# EAGLE design Top (EAGLE 9.6.2)
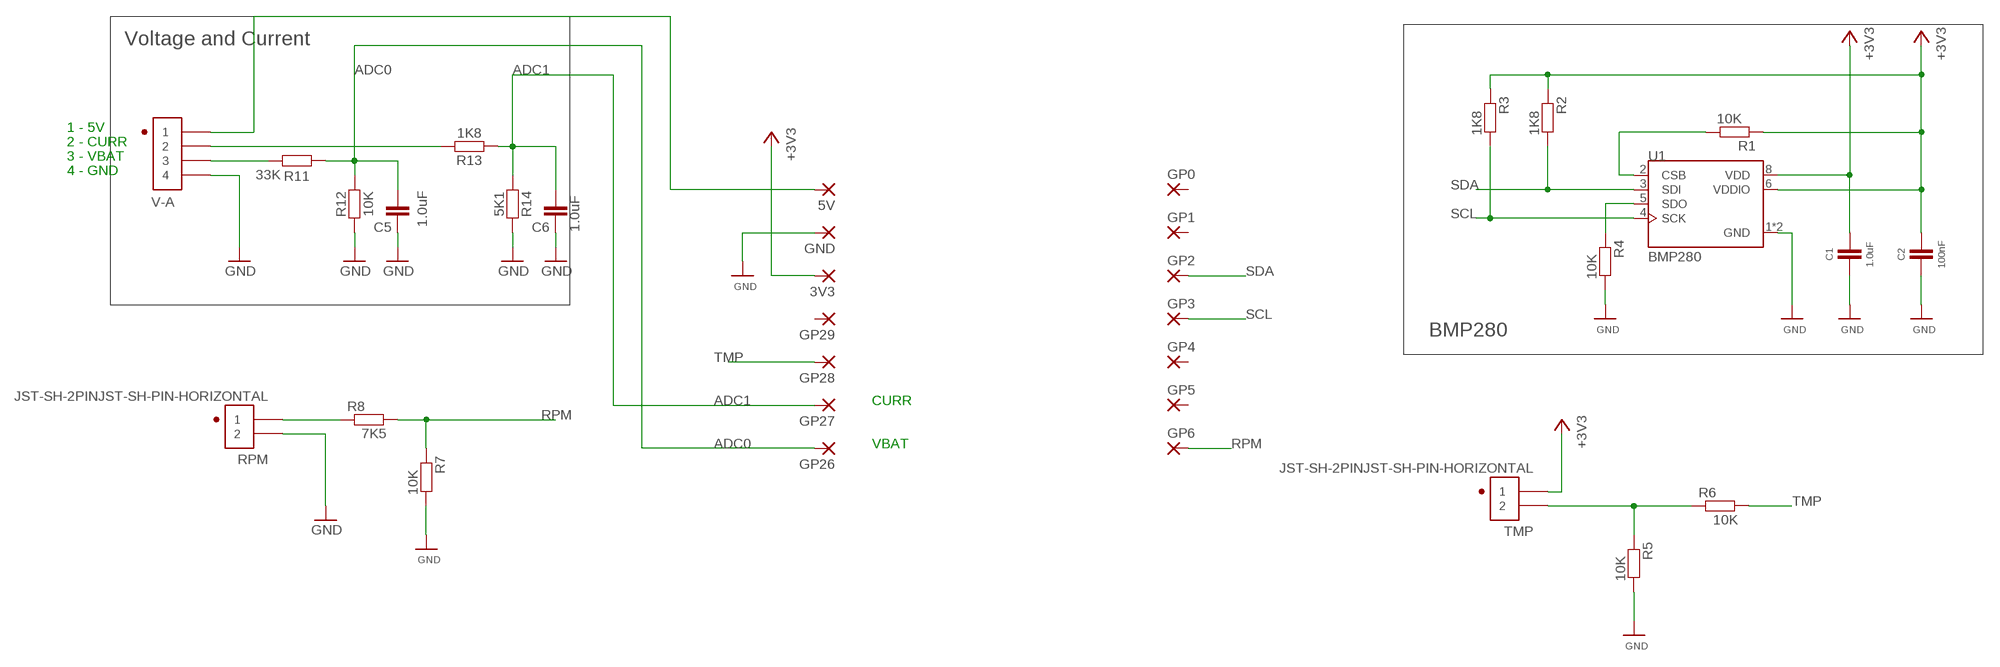
[diagram p0: schematic, sheet 1]

## Parts
3V3  1,6/0,9  [1,6/0,9]
5V  1,6/0,9  [1,6/0,9]
C1  1.0uF  1.0UF-0402-16V-10%  [0402]
C2  100nF  1.0UF-0603-16V-10%  [0603]
C5  1.0uF  1.0UF-0603-16V-10%-X7R  [0603]
C6  1.0uF  1.0UF-0603-16V-10%-X7R  [0603]
GND  1,6/0,9  [1,6/0,9]
GP0  1,6/0,9  [1,6/0,9]
GP1  1,6/0,9  [1,6/0,9]
GP2  1,6/0,9  [1,6/0,9]
GP3  1,6/0,9  [1,6/0,9]
GP4  1,6/0,9  [1,6/0,9]
GP5  1,6/0,9  [1,6/0,9]
GP6  1,6/0,9  [1,6/0,9]
GP26  1,6/0,9  [1,6/0,9]
GP27  1,6/0,9  [1,6/0,9]
GP28  1,6/0,9  [1,6/0,9]
GP29  1,6/0,9  [1,6/0,9]
R1  10K  RESISTOR0603  [0603]
R2  1K8  RESISTOR0603  [0603]
R3  1K8  RESISTOR0603  [0603]
R4  10K  RESISTOR0603  [0603]
R5  10K  RESISTOR0603  [0603]
R6  10K  RESISTOR0603  [0603]
R7  10K  RESISTOR0603  [0603]
R8  7K5  RESISTOR0603  [0603]
R11  33K  RESISTOR0603  [0603]
R12  10K  RESISTOR0603  [0603]
R13  1K8  RESISTOR0603  [0603]
R14  5K1  RESISTOR0603  [0603]
RPM  JST-SH-2PINJST-SH-PIN-HORIZONTAL  [JST-SH-2PIN-1.0MM]
TMP  JST-SH-2PINJST-SH-PIN-HORIZONTAL  [JST-SH-2PIN-1.0MM]
U1  BMP280  [XDCR_BMP280]
V-A  JST-SH-4PINJST-SH-4-HORIZONTAL  [JST-SH-4PIN-1.0MM]

## Nets
+3V3: 3V3.1(P) C1.1 C2.1 R1.1 R2.1 R3.1 TMP.1 U1.6(VDDIO) U1.8(VDD)
ADC0: C5.2 GP26.1(P) R11.2 R12.2
ADC1: C6.2 GP27.1(P) R13.1 R14.1
GND: C1.2 C2.2 C5.1 C6.1 GND.1(P) R4.2 R5.2 R7.2 R12.1 R14.2 RPM.2 U1.1(GND) U1.7(GND) V-A.4
N$1: R1.2 U1.2(CSB)
N$2 [power]: R4.1 U1.5(SDO)
N$3 [power]: R5.1 R6.1 TMP.2
N$4: R8.1 RPM.1
N$6: R11.1 V-A.3
N$7: R13.2 V-A.2
N$8: 5V.1(P) V-A.1
RPM: GP6.1(P) R7.1 R8.2
SCL: GP3.1(P) R3.2 U1.4(SCK)
SDA: GP2.1(P) R2.2 U1.3(SDI)
TMP: GP28.1(P) R6.2
Unconnected: GP0.1(P) GP1.1(P) GP4.1(P) GP5.1(P) GP29.1(P)

## Notes on the sheet
- Voltage and Current
- 1 - 5V
- 2 - CURR
- 3 - VBAT
- 4 - GND
- BMP280
- CURR
- VBAT

## Library data of the parts
3V3 5V GND GP0 GP1-GP6 GP26-GP29 = Codeworks-Pads:1,6/0,9: THROUGH-HOLE PAD
C1 = CodeWorks-Capacitors:1.0UF: 1µF ceramic capacitors A capacitor is a passive two-terminal electrical component used to store electrical energy temporarily in an electric field.; PROD_ID: CAP-12417
C2 = CodeWorks-Capacitors:1.0UF: 1µF ceramic capacitors A capacitor is a passive two-terminal electrical component used to store electrical energy temporarily in an electric field.; PROD_ID: CAP-00868; VALUE: 1.0uF
C5 C6 = CodeWorks-Capacitors:1.0UF: 1µF ceramic capacitors A capacitor is a passive two-terminal electrical component used to store electrical energy temporarily in an electric field.; PROD_ID: CAP-13930
R1-R8 R11-R14 = CodeWorks-Resistors:RESISTOR: Generic Resistor Package
RPM TMP = CodeWorks-Connectors:JST-SH-2PIN
U1 = Codeworks-Sensors:BMP280: BMP280 Absolute Barometric Pressure Sensor for Battery Powered Devices 2 x 2.5mm Check availability <https://pricing.snapeda.com/parts/BMP280/Bosch/view-part?ref=eda>; AVAILABILITY: In Stock; CHECK_PRICES: https://www.snapeda.com/parts/BMP280/Bosch+Sensortec/view-part/?ref=eda; DESCRIPTION: Pressure Sensor 4.35PSI ~ 15.95PSI (30kPa ~ 110kPa) Absolute - 16b 8-SMD; MF: Bosch; MP: BMP280; PACKAGE: SMD-8 Bosch Sensortec; PRICE: None; PURCHASE-URL: https://www.snapeda.com/api/url_track_click_mouser/?unipart_id=1186631&manufacturer=Bosch&part_name=BMP280&search_term=None; SNAPEDA_LINK: https://www.snapeda.com/parts/BMP280/Bosch+Sensortec/view-part/?ref=snap
V-A = CodeWorks-Connectors:JST-SH-4PIN

## Net classes
1 power: width 0.305 mm

## Board
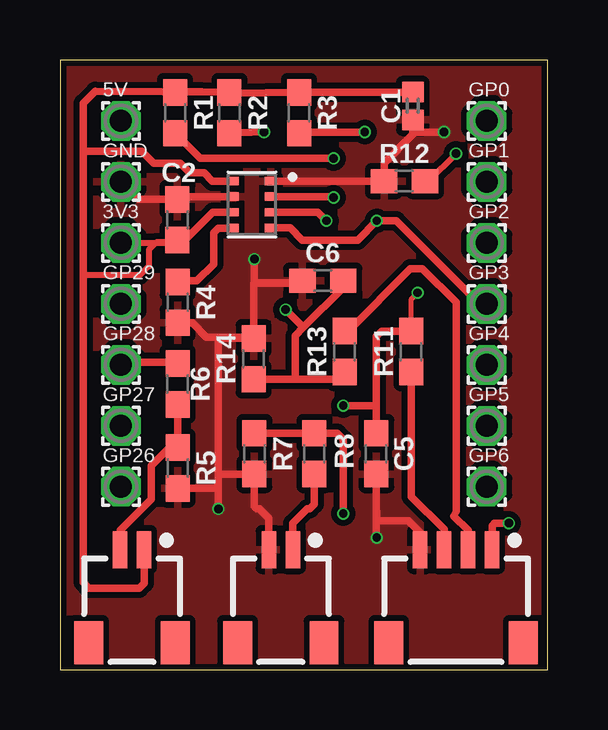
[diagram p1: board, top side]
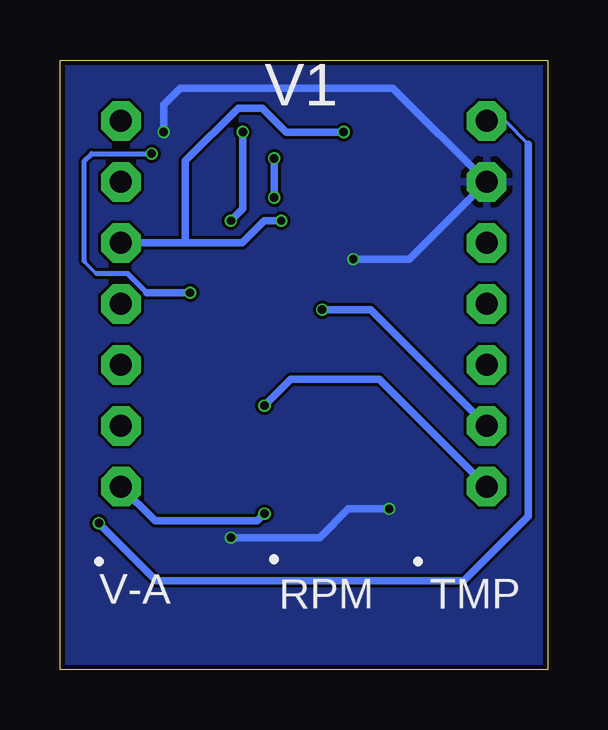
[diagram p2: board, bottom side, seen from below]

Size 20.32 x 25.4 mm. Coordinates in mm from the lower left corner, seen from the top.
Outline: 0,0 20.32,0 20.32,25.4 0,25.4 0,0
Copper layers (1*16): Top 0.035mm / dielectric 1.6mm / Bottom 0.035mm
Design rules "jlcpcb-2layers": minimum track width 5mil, minimum drill 0.3mm, track to track 5mil, track to pad 5mil, pad to pad 5mil, via to via 5mil, smd to smd 5mil, copper to edge 0.2mm, drill to drill 6mil, minimum pad ring 10mil, minimum via ring 3mil, stop-mask expansion 4mil, vias tented up to drill 0mil, thermal gap 10mil

### Footprints (pad centres in the part's own frame; a part is rotated, then mirrored left to right if it is on the bottom)
1,6/0,9 = drill 0.914 pad 1.6 octagon: 1 0,0
0402 = smd 0.85 x 0.9: 1 -0.58,0; 2 0.58,0
0603 = smd 1.1 x 1: 1 -0.85,0; 2 0.85,0
JST-SH-2PIN-1.0MM = smd 0.6 x 1.55: 1 0,0; 2 1,0 | smd 1.2 x 1.8: M1 -1.3,3.875; M2 2.3,3.875
XDCR_BMP280 = smd 0.5 x 0.35: 1 0.8,0.975; 2 0.8,0.325; 3 0.8,-0.325; 4 0.8,-0.975; 5 -0.8,-0.975; 6 -0.8,-0.325; 7 -0.8,0.325; 8 -0.8,0.975
JST-SH-4PIN-1.0MM = smd 0.6 x 1.55: 1 0,0; 2 1,0; 3 2,0; 4 3,0 | smd 1.2 x 1.8: M1 -1.3,3.875; M2 4.3,3.875

### Placement (x,y rotation side)
3V3  2.54,17.78 0 top
5V  2.54,22.86 0 top
C1  14.71,23.48 270 top
C2  4.89,18.75 90 top
C5  13.18,9 90 top
C6  10.95,16.21 0 top
GND  2.54,20.32 0 top
GP0  17.78,22.86 0 top
GP1  17.78,20.32 0 top
GP2  17.78,17.78 0 top
GP3  17.78,15.24 0 top
GP4  17.78,12.7 0 top
GP5  17.78,10.16 0 top
GP6  17.78,7.62 0 top
GP26  2.54,7.62 0 top
GP27  2.54,10.16 0 top
GP28  2.54,12.7 0 top
GP29  2.54,15.24 0 top
R1  4.79,23.2 270 top
R2  7.06,23.2 270 top
R3  9.96,23.2 270 top
R4  4.9,15.3 270 top
R5  4.9,8.4 270 top
R6  4.9,11.9 90 top
R7  8.1,9 270 top
R8  10.6,9 90 top
R11  14.64,13.25 90 top
R12  14.35,20.35 0 top
R13  11.86,13.25 90 top
R14  8.07,12.95 90 top
RPM  9.7,5 180 top
TMP  3.5,5 180 top
U1  7.99,19.38 0 top
V-A  18,5 180 top

### Tracks (layer width: path | path; a pad name or v marks a point on that pad's centre or on a via)
+3V3
  Top 0.152: 0.97,16.44 | C2.1 4.8,17.8
  Top 0.254: 4.8,17.8 4,17.8 3.7,17.5 3.7,16.8 3.34,16.44 0.97,16.44 | 3V3.1 4.78,17.78 C2.1
  Top 0.305: 0.97,16.44 0.97,3.63 1.2,3.4 3.3,3.4 3.5,3.6 TMP.1 | U1.6 6.36,19.05 5.2,17.89 C2.1 | C1.1 10.01,24.07 R3.1 7.13,24.02 R2.1 | R2.1 4.85,24.1 R1.1 | R2.1 1.47,24.1 0.97,23.6 0.97,21.6 | 0.97,21.6 0.97,16.44 | U1.8 6.34,20.36 6,20.7 5.4,20.7 5,21.1 3.9,21.1 3.4,21.6 0.97,21.6
ADC0  (via drill 0.35)
  Top 0.152: 15.35,20.35 R12.2
  Top 0.203: R11.2 14.64,15.44 v14.9,15.7
  Top 0.254: v16.5,21.5 15.35,20.35
  Top 0.305: C5.2 13.18,11 | 13.18,11 13.18,13.88 13.4,14.1 R11.2 | v11.8,11 13.18,11
  Bottom 0.152: 18.8,16.5 19.3,17
  Bottom 0.203: 16.7,15.7 17.5,16.5 18.8,16.5 | v16.5,21.5 19,21.5 19.3,21.2 19.3,17
  Bottom 0.305: v14.9,15.7 16.7,15.7 | GP26.1 7.02,12.1 10.7,12.1 v11.8,11
ADC1  (via drill 0.35)
  Top 0.305: R13.1 11.56,12.1 9.8,12.1 | C6.2 11.8,15.91 10.14,14.26 | 10.14,14.26 9.8,13.91 9.8,12.1 | R14.1 9.8,12.1 | v9.4,15 10.14,14.26
  Bottom 0.305: GP27.1 7.38,15 v9.4,15
GND  (via drill 0.35)
  Top 0.305: V-A.4 15,5.7 14.5,6.2 13.2,6.2 13.18,7.12 | 13.18,7.12 C5.1 | R4.2 5.5,14.45 6.1,13.85 8.02,13.85 R14.2 | GND.1 3.27,19.59 C2.2 5,19.7 U1.7 | U1.1 R12.1 13.5,21.1 14.71,22.3 C1.2 14.71,22.4 v16,22.4 | 6.6,7.55 v6.6,6.7 | v13.2,5.5 13.18,5.52 13.18,7.12 | R14.2 8.07,16.1 9.99,16.1 C6.1 10,16.11 8.1,16.11 v8.1,17.1 | 6.6,8.15 R7.2 8.1,6.8 8.2,6.7 8.3,6.7 8.7,6.3 RPM.2 | 6.6,7.55 R5.2 | R14.2 6.6,13.8 6.6,8.15 | 6.6,8.15 6.6,7.55
  Bottom 0.305: v6.6,6.7 8.3,6.7 9.5,5.5 v13.2,5.5 | v16,22.4 16,23.53 15.3,24.23 6.45,24.23 GND.1 5.76,17.1 v8.1,17.1
  pour Top (isolate 0.254): 0.2,0.2 20.1,0.2 20.1,25.2 0.2,25.2
  pour Bottom: 0.2,0.2 20.1,0.2 20.1,25.2 0.3,25.2 0.3,0.3
N$1  (via drill 0.35)
  Top 0.305: R1.2 5.84,21.3 v11.4,21.3 | v11.4,19.67 11.4,19.7 U1.2
  Bottom 0.305: v11.4,21.3 v11.4,19.67
N$2
  Top 0.305: U1.5 6.6,18.4 6.4,18.2 6.4,16.9 5.7,16.2 4.9,16.2 R4.1
N$3
  Top 0.305: R6.1 R5.1 4.55,9.25 3.8,8.5 3.8,7.1 2.5,5.8 TMP.2
N$4
  Top 0.305: RPM.1 9.7,6.1 10.3,6.7 10.4,6.7 10.6,6.9 R8.1
N$6
  Top 0.305: R11.1 14.64,7.2 16,5.84 V-A.3
N$7
  Top 0.305: V-A.2 17,5.8 16.41,6.39 16.5,6.6 16.5,15.3 15.1,16.7 14.6,16.7 12,14.1 R13.2
N$8  (via drill 0.35)
  Top 0.305: V-A.1 18,6 18.1,6.1 v18.7,6.1
  Bottom 0.152: 5V.1 1.76,22.86 0.8,21.9
  Bottom 0.305: v18.7,6.1 16.3,3.7 3.5,3.7 0.8,6.4 0.8,21.9
RPM  (via drill 0.35)
  Top 0.305: R7.1 R8.2 11.55,9.85 11.8,9.6 v11.8,6.5
  Bottom 0.305: GP6.1 16.36,6.2 12.1,6.2 v11.8,6.5
SCL  (via drill 0.35)
  Top 0.305: U1.4 9.6,18.41 10.1,17.9 12.4,17.9 v13.2,18.7 14,18.7 17.46,15.24 GP3.1 | v12.7,22.4 10.04,22.4 R3.2
  Bottom 0.305: v13.2,18.7 12.7,19.2 v12.7,22.4
SDA  (via drill 0.35)
  Top 0.305: U1.3 10.74,19.05 v11.1,18.7 | R2.2 v8.5,22.4
  Bottom 0.305: v11.1,18.7 11.8,18.7 12.72,17.78 15.1,17.78 | 15.1,17.78 GP2.1 | v8.5,22.4 10.9,22.4 11.9,23.4 12.9,23.4 15.1,21.2 15.1,17.78
TMP
  Top 0.305: R6.2 4.85,12.8 2.64,12.8 GP28.1

### Text on the board
bNames: V1